# EAGLE design switch-2layer (EAGLE 9.2.2)
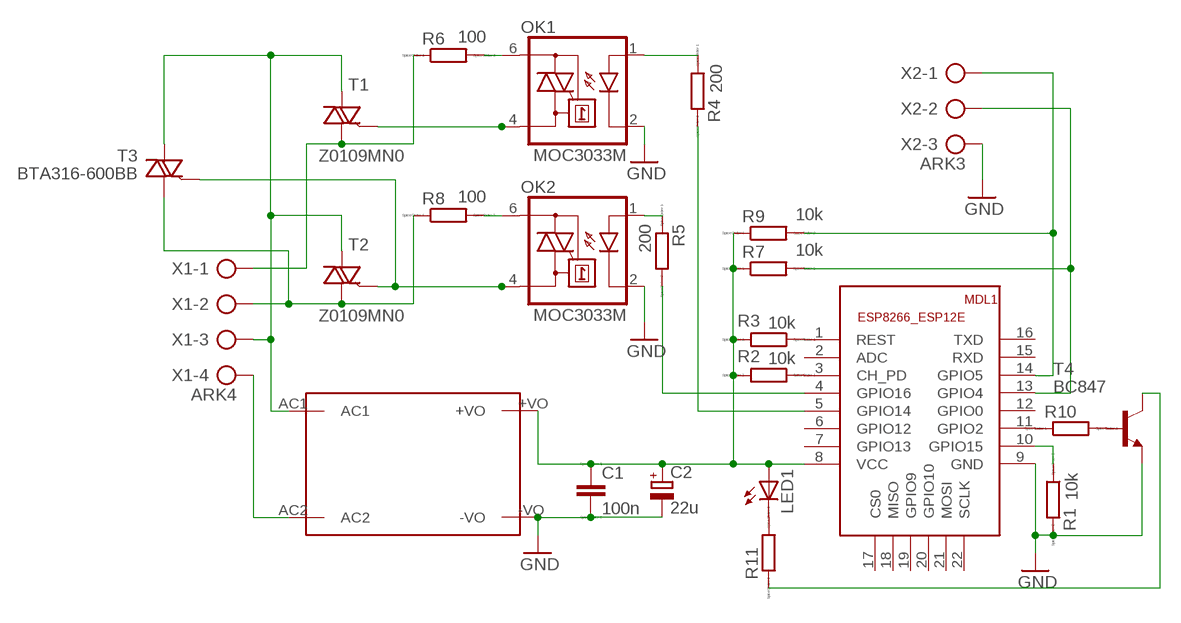
[diagram p0: schematic, sheet 1]

## Parts
C1  100n  CC1206  [C1206]
C2  22u  CPOL-EUE2.5-6  [E2,5-6]
LED1  LEDSMT1206  [1206]
MDL1  ESP12-F  ESP8266-12EESP8266-ESP12E  [ESP8266-ESP12E]
OK1  MOC3033M  [DIL06]
OK2  MOC3033M  [DIL06]
R1  10k  RR1206  [R1206]
R2  10k  RR1206  [R1206]
R3  10k  RR1206  [R1206]
R4  200  RR1206  [R1206]
R5  200  RR1206  [R1206]
R6  100  RR1206  [R1206]
R7  10k  RR1206  [R1206]
R8  100  RR1206  [R1206]
R9  10k  RR1206  [R1206]
R10  RR1206  [R1206]
R11  RR1206  [R1206]
T1  Z0109MN0  [SOT223]
T2  Z0109MN0  [SOT223]
T3  BTA316-600BB  [SOT404]
T4  BC847  [SOT23]
U$1  HLK-PM03  [HLK-PM03]
X1  ARK4  AK500/4  [AK500/4]
X2  ARK3  AK500/3  [AK500/3]

## Nets
GND: C1.2 C2.- MDL1.9(GND) OK1.2(C) OK2.2(C) R1.2 T4.2(E) U$1.-VO X2.3
N$1: MDL1.10(GPIO15) R1.1
N$2: MDL1.1(REST) R3.1
N$3: MDL1.3(CH_PD) R2.1
N$4: C1.1 C2.+ LED1.A MDL1.8(VCC) R2.2 R3.2 R7.1 R9.1 U$1.+VO
N$5: OK1.6(A2) R6.2
N$6: MDL1.11(GPIO2) R10.1
N$7: OK2.6(A2) R8.2
N$8: R10.2 T4.1(B)
N$9: OK2.1(A) R5.1
N$10: OK1.1(A) R4.1
N$11: MDL1.4(GPIO16) R5.2
N$12: MDL1.5(GPIO14) R4.2
N$14: OK1.4(A1) T1.3(G)
N$15: R8.1 T2.2(CM) T2.4(CM) T3.MB(CM) X1.2
N$16: OK2.4(A1) T2.3(G) T3.3(G)
N$17: U$1.AC2 X1.4
N$18: LED1.C R11.2
N$19: T1.1(LD) T2.1(LD) T3.1(LD) U$1.AC1 X1.3
N$20: MDL1.14(GPIO5) R9.2 X2.1
N$21: MDL1.13(GPIO4) R7.2 X2.2
N$22: R6.1 T1.2(CM) T1.4(CM) X1.1
N$23: R11.1 T4.3(C)
Unconnected: MDL1.2(ADC) MDL1.6(GPIO12) MDL1.7(GPIO13) MDL1.12(GPIO0) MDL1.15(RXD) MDL1.16(TXD) MDL1.17(CS0) MDL1.18(MISO) MDL1.19(GPIO9) MDL1.20(GPIO10) MDL1.21(MOSI) MDL1.22(SCLK)

## Library data of the parts
C1 = eagle-ltspice:C: CAPACITOR, European symbol; SPICEMODEL: NONE; SPICEPREFIX: C
C2 = rcl:CPOL-EU: POLARIZED CAPACITOR, European symbol; SPICEPREFIX: C
LED1 = led:LED: LED OSRAM: - CHIPLED LG R971, LG N971, LY N971, LG Q971, LY Q971, LO R971, LY R971 LH N974, LH R974 LS Q976, LO Q976, LY Q976 LO Q996 - Hyper CHIPLED LW Q18S LB Q993, LB Q99A, LB R99A - SideLED LS A670, LO A670, LY A670, LG A670, LP A670 LB A673, LV A673, LT A673, LW A673 LH A674 LY A675 LS A676, LA A676, LO A676, LY A676, LW A676 LS A679, LY A679, LG A679 - Hyper Micro SIDELED® LS Y876, LA Y876, LO Y876, LY Y876 LT Y87S - SmartLED LW L88C, LW L88S LB L89C, LB L89S, LG L890 LS L89K, LO L89K, LY L89K LS L896, LA L896, LO L896, LY L896 - TOPLED LS T670, LO T670, LY T670, LG T670, LP T670 LSG T670, LSP T670, LSY T670, LOP T670, LYG T670 LG T671, LOG T671, LSG T671 LB T673, LV T673, LT T673, LW T673 LH T674 LS T676, LA T676, LO T676, LY T676, LB T676, LH T676, LSB T676, LW T676 LB T67C, LV T67C, LT T67C, LS T67K, LO T67K, LY T67K, LW E67C LS E67B, LA E67B, LO E67B, LY E67B, LB E67C, LV E67C, LT E67C LW T67C LS T679, LY T679, LG T679 LS T770, LO T770, LY T770, LG T770, LP T770 LB T773, LV T773, LT T773, LW T773 LH T774 LS E675, LA E675, LY E675, LS T675 LS T776, LA T776, LO T776, LY T776, LB T776 LHGB T686 LT T68C, LB T68C - Hyper Mini TOPLED® LB M676 - Mini TOPLED Santana® LG M470 LS M47K, LO M47K, LY M47K Source: http://www.osram.convergy.de LUXEON: - LUMILED® LXK2-PW12-R00, LXK2-PW12-S00, LXK2-PW14-U00, LXK2-PW14-V00 LXK2-PM12-R00, LXK2-PM12-S00, LXK2-PM14-U00 LXK2-PE12-Q00, LXK2-PE12-R00, LXK2-PE12-S00, LXK2-PE14-T00, LXK2-PE14-U00 LXK2-PB12-K00, LXK2-PB12-L00, LXK2-PB12-M00, LXK2-PB14-N00, LXK2-PB14-P00, LXK2-PB14-Q00 LXK2-PR12-L00, LXK2-PR12-M00, LXK2-PR14-Q00, LXK2-PR14-R00 LXK2-PD12-Q00, LXK2-PD12-R00, LXK2-PD12-S00 LXK2-PH12-R00, LXK2-PH12-S00 LXK2-PL12-P00, LXK2-PL12-Q00, LXK2-PL12-R00 Source: www.luxeon.com KINGBRIGHT: KA-3528ASYC Source: www.kingbright.com
MDL1 = ESP8266-ESP12E:ESP8266-12E: ESP8266-12E with additional I/O and GPIO04/05 corrected The author cannot warrant that this library is free from error or will meet your specific requirements. Created by PuceBaboon.com. Komagane, Nagano, JAPAN
OK1 OK2 = optocoupler:MOC30*: 6-Pin DIP Zero-Cross Optoisolators Triac Driver Output (250/400 Volt Peak) Source: Data sheet <http://www.fairchildsemi.com/ds/MO/MOC3031M.pdf> The old path of data sheet not more available 2013-05-06.; MF: FAIRCHILD SEMICONDUCTOR; MPN: MOC3033-M; OC_FARNELL: 1133987; OC_NEWARK: 72K8898
R1-R11 = eagle-ltspice:R: RESISTOR, European symbol; SPICEMODEL: NONE; SPICEPREFIX: R
T1 T2 = nxp_60_1_1:Z0109MN0: 4Q Triac Planar passivated sensitive gate four quadrant triac in a SOT223 (SC-73) surface-mountable plastic package intended for applications requiring enhanced immunity to noise and direct interfacing to logic level ICs and low power gate drivers. AAL Eindhoven MK; 12NC: 9340 650 56135
T3 = nxp_60:BTA316: Planar passivated high commutation three quadrant triac in a SOT78 plastic package intended for use in circuits where high static and dynamic dV/dt and high dI/dt can occur AAL Eindhoven MV+ MK; 12NC: 9340 601 04118
T4 = nxp_60:BC847: 45 V, 100 mA NPN general-purpose transistors NPN general-purpose transistor AAL Eindhoven MK
U$1 = PowerSocket:HLK-PM03
X1 = con-ptr500:AK500/4: CONNECTOR; OC_FARNELL: unknown; OC_NEWARK: unknown
X2 = con-ptr500:AK500/3: CONNECTOR; OC_FARNELL: unknown; OC_NEWARK: unknown

## Board
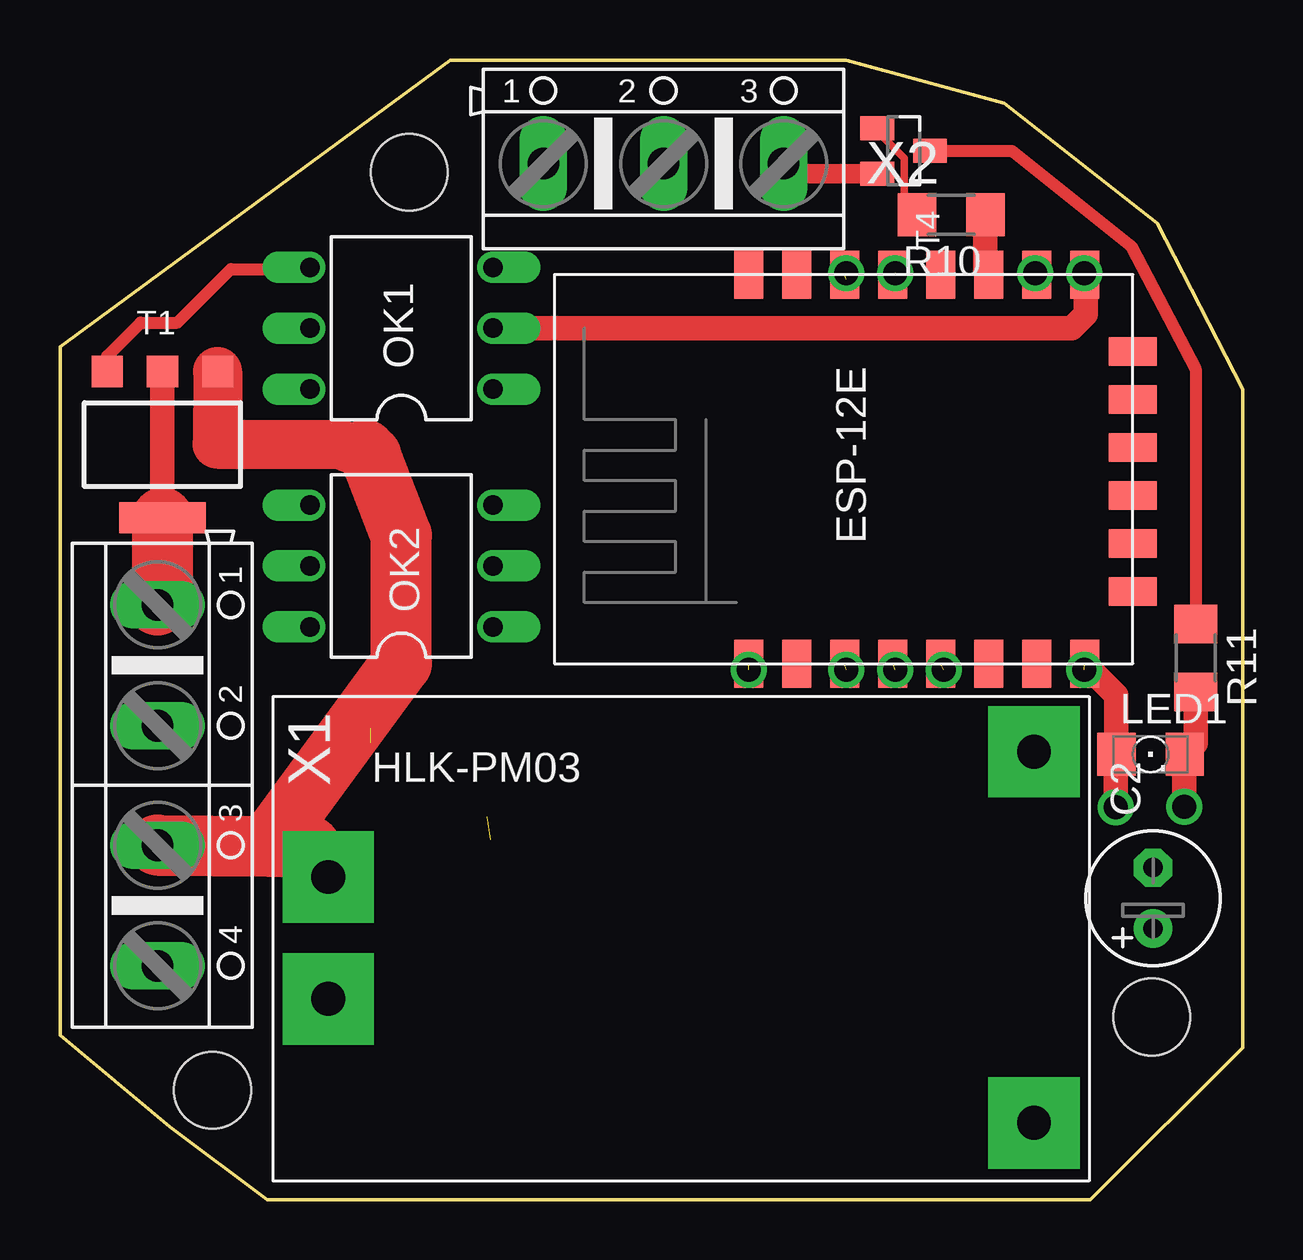
[diagram p1: board, top side]
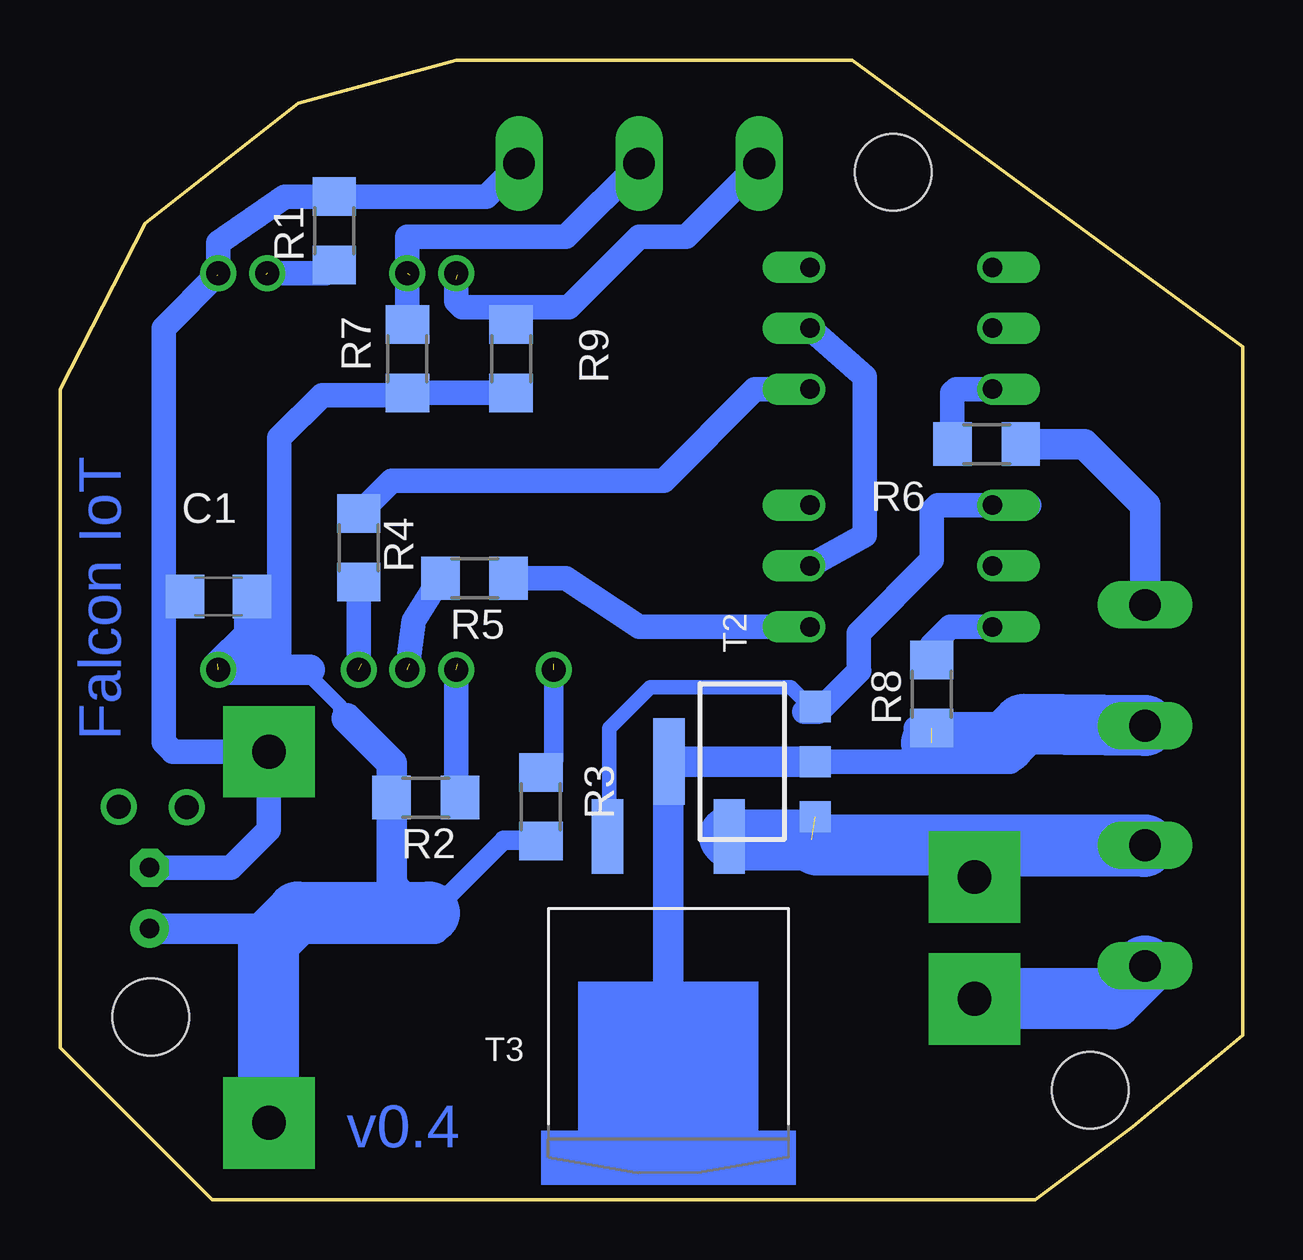
[diagram p2: board, bottom side, seen from below]

Size 49.28 x 47.5 mm. Coordinates in mm from the lower left corner, seen from the top.
Outline: 42.93,0 49.28,6.35 49.28,33.78 45.72,40.69 39.34,45.7 32.77,47.5 16.26,47.5 0,35.56 0,6.86 4.57,3.05 8.64,0 42.93,0
Copper layers (1*16): Top 0.035mm / dielectric 1.5mm / Bottom 0.035mm
Design rules "default": minimum track width 6mil, minimum drill 0.35mm, track to track 6mil, track to pad 6mil, pad to pad 6mil, via to via 6mil, smd to smd 6mil, copper to edge 40mil, drill to drill 6mil, minimum pad ring 10mil, minimum via ring 8mil, stop-mask expansion 4mil, vias tented up to drill 0mil, thermal gap 10mil
Holes 3.2 mm at 6.35,4.57 45.49,7.62 14.55,42.82

### Footprints (pad centres in the part's own frame; a part is rotated, then mirrored left to right if it is on the bottom)
C1206 = smd 1.6 x 1.8: 1 -1.4,0; 2 1.4,0
E2,5-6 = drill 0.813 pad 1.6: + -1.27,0 | drill 0.813 pad 1.6 octagon: - 1.27,0
1206 = smd 1.6 x 1.803: A -1.422,0; C 1.422,0
ESP8266-ESP12E = smd 2 x 1.2: 1 0,16; 2 0,14; 3 0,12; 4 0,10; 5 0,8; 6 0,6; 7 0,4; 8 0,2; 9 16.2,2; 10 16.2,4; 11 16.2,6; 12 16.2,8; 13 16.2,10; 14 16.2,12; 15 16.2,14; 16 16.2,16 | smd 1.2 x 2: 17 11,0; 18 3,0; 19 5,0; 20 13,0; 21 7,0; 22 9,0
DIL06 = drill 0.813 offset: 1 -2.54,-3.81; 2 0,-3.81; 3 2.54,-3.81; 4 2.54,3.81; 5 0,3.81; 6 -2.54,3.81
R1206 = smd 1.6 x 1.803: 1 -1.422,0; 2 1.422,0
SOT223 = smd 1.3 x 1.3: 1 -2.3,-3.05; 2 0,-3.05; 3 2.3,-3.05 | smd 3.6 x 1.3: 4 0,3.05
SOT404 = smd 1.3 x 3.1: 1 -2.54,-6.35; 3 2.54,-6.35 | smd 0 x 0: MB 0,0
SOT23 = smd 1 x 1.4: 1 -0.95,-1.1; 2 0.95,-1.1; 3 0,1.1
HLK-PM03 = drill 1.4 pad 3.81 square: +VO 29.4,-5.167; -VO 29.4,10.294; AC1 0,5.08; AC2 0,0
AK500/4 = drill 1.321 long: 1 -7.518,0; 2 -2.489,0; 3 2.489,0; 4 7.518,0
AK500/3 = drill 1.321 long: 1 -5.004,0; 2 0,0; 3 5.004,0

### Placement (x,y rotation side)
C1  42.67,25.15 180 bottom
C2  45.54,12.57 90 top
LED1  45.44,18.57 0 top
MDL1  44.7,22.35 90 top
OK1  14.22,36.32 90 top
OK2  14.22,26.42 90 top
R1  37.85,40.39 90 bottom
R2  34.04,16.76 180 bottom
R3  29.24,16.38 270 bottom
R4  36.83,27.18 270 bottom
R5  32,25.91 180 bottom
R6  10.67,31.5 180 bottom
R7  34.8,35.05 90 bottom
R8  12.95,21.08 90 bottom
R9  30.48,35.05 90 bottom
R10  37.13,41.05 180 top
R11  47.32,22.58 270 top
T1  4.27,31.47 180 top
T2  20.85,18.26 90 bottom
T3  23.93,8.79 180 bottom
T4  35.15,43.71 270 top
U$1  11.18,8.38 0 top
X1  4.06,17.27 270 top
X2  25.15,43.18 0 top

### Tracks (layer width: path | path; a pad name or v marks a point on that pad's centre or on a via)
GND  (via drill 1)  (1 unrouted)
  Top 0.813: X2.3 30.57,42.76 T4.2
  Top 1.016: OK1.2 42.16,36.32 42.75,36.91 42.75,38.53 v42.67,38.61
  Bottom 0.152: C1.2 44.96,25.15
  Bottom 1.016: OK2.2 15.75,27.69 15.75,34.29 OK1.2 | X2.3 31.52,41.81 R1.2 39.92,41.81 42.67,39.88 v42.67,38.61 44.96,36.32 44.96,25.15 44.96,19.07 44.58,18.7 44.58,18.68 U$1.-VO 40.58,15.43 42.16,13.84 C2.-
N$1  (via drill 1)  (1 unrouted)
  Bottom 1.016: R1.1 38.2,38.61 v40.64,38.61
N$2  (via drill 1)  (1 unrouted)
  Bottom 0.813: v28.7,22.1 28.7,18.34 R3.1
N$3  (via drill 1)  (1 unrouted)
  Bottom 1.016: R2.1 32.77,16.76 v32.77,22.1
N$4  (via drill 1)  (1 unrouted)
  Top 1.016: MDL1.8 44.02,21.04 LED1.A
  Bottom 0.61: 37.34,20.07 37.59,20.32 37.59,20.57 38.86,21.84 38.86,22.1
  Bottom 0.813: 35.05,12.7 33.07,12.7 30.79,14.99 29.26,14.99 R3.2
  Bottom 1.016: R9.1 R7.1 34.9,33.53 38.35,33.53 40.13,31.75 40.13,22.1 | 40.64,22.1 40.64,22.35 40.89,22.61
  Bottom 1.27: U$1.+VO 40.64,3.28 40.64,11.3 C2.+ 33.66,11.3 35.05,12.7 35.46,13.11 R2.2 35.46,18.19 37.34,20.07 | 38.86,22.1 40.13,22.1 40.64,22.1 v42.67,22.1
  Bottom 1.524: C1.1 41.27,23.5 v42.67,22.1
  Bottom 2.54: U$1.+VO 40.58,10.78 39.37,11.99 33.91,11.99 33.88,11.96
N$5
  Bottom 1.016: OK1.6 11.94,33.78 12.09,33.63 R6.2
N$6
  Top 1.016: R10.1 38.56,38.7 MDL1.11
N$7
  Bottom 1.016: OK2.6 12.19,23.88 12.95,23.11 R8.2
N$8
  Top 0.305: T4.1 34.05,44.53 35.18,43.41 35.18,41.58 R10.2
N$9
  Bottom 1.016: OK2.1 25.15,23.88 28.19,25.91 R5.1
N$10
  Bottom 1.016: R4.1 35.46,29.97 24.13,29.97 20.32,33.78 OK1.1
N$11  (via drill 1)  (1 unrouted)
  Bottom 1.016: R5.2 34.54,24.13 v34.8,22.1
N$12  (via drill 1)  (1 unrouted)
  Bottom 1.016: R4.2 v36.83,22.1
N$13  (via drill 1)
  other vias: 32.77,38.61
N$14
  Top 0.508: T1.3 1.97,35.16 3.35,36.55 4.89,36.55 7.12,38.78 10.34,38.78 OK1.4
  Top 1.016: T1.3 1.97,34.63
N$15  (1 unrouted)
  Bottom 1.016: 13.61,19.66 R8.1 | T2.2 9.68,18.26 9.47,18.47 9.47,19.48 9.14,19.81
  Bottom 1.27: T3.MB 23.93,18.24 T2.4 T2.2
  Bottom 2.54: X1.2 9.14,19.81 9.91,19.05 12.95,19.05
N$16
  Bottom 0.61: 18.03,20.56 18.83,21.36 24.69,21.36 26.39,19.66 26.39,15.21 T3.3
  Bottom 1.016: 8.89,28.96 OK2.4 12.7,28.96 12.95,28.7 12.95,26.67 16,23.62 16,22.07 15.98,22.05 17.69,20.33 18.26,20.33 18.03,20.56 T2.3
N$17
  Bottom 2.54: X1.4 5.44,8.38 U$1.AC2
N$18
  Top 1.016: LED1.C 47.32,19.02 R11.2
N$19  (1 unrouted)
  Top 2.032: T1.1 6.55,31.5 11.68,31.5 12.95,30.99
  Top 2.54: X1.3 8.63,14.75 | 8.63,14.75 10.41,14.73 U$1.AC1 | 8.63,14.75 14.22,22.35 14.22,27.69 12.95,30.99 12.7,31.24
  Bottom 2.54: 10.41,14.73 4.12,14.73 X1.3 17.73,14.78 17.96,15.01 21.26,15.01 T3.1 | U$1.AC1 11.68,12.95
N$20  (1 unrouted)
  Bottom 0.152: R9.2 30.48,37.2
  Bottom 1.016: X2.1 23.19,40.13 25.15,40.13 28.08,37.2 30.48,37.2 32.51,37.2 32.77,37.45 32.77,38.35
N$21  (via drill 1)  (1 unrouted)
  Bottom 1.016: X2.2 28.19,40.13 34.8,40.13 v34.8,38.61 R7.2
N$22
  Top 1.016: T1.2 T1.4
  Top 2.54: T1.4 4.27,24.99 X1.1
  Bottom 1.27: R6.1 6.6,31.5 4.06,28.96 X1.1
N$23
  Top 0.508: R11.1 47.32,34.61 44.63,39.74 39.67,43.71 T4.3
N$24  (via drill 1)
  Top 1.016: v43.99,16.36 43.99,18.41
N$25  (via drill 1)
  Top 1.016: v46.84,16.38 46.84,18.49

### Text on the board
Bottom: Falcon IoT | v0.4